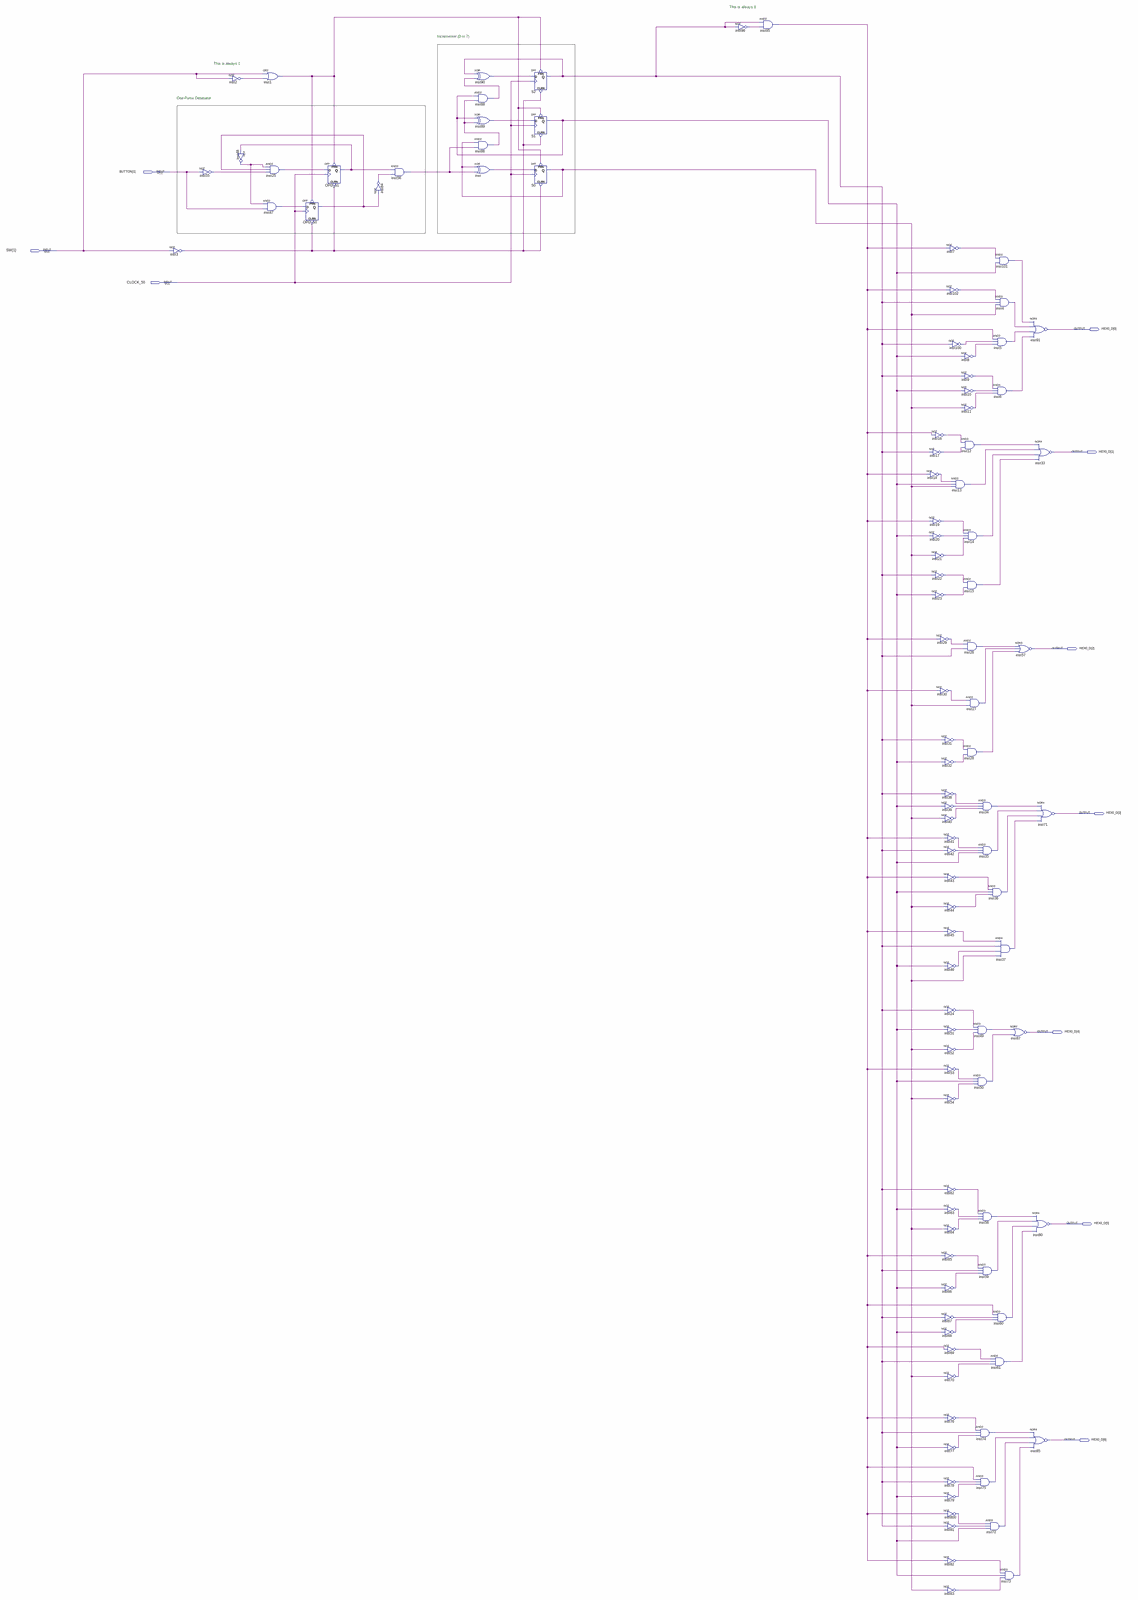
[diagram p0: schematic sheet, whole]
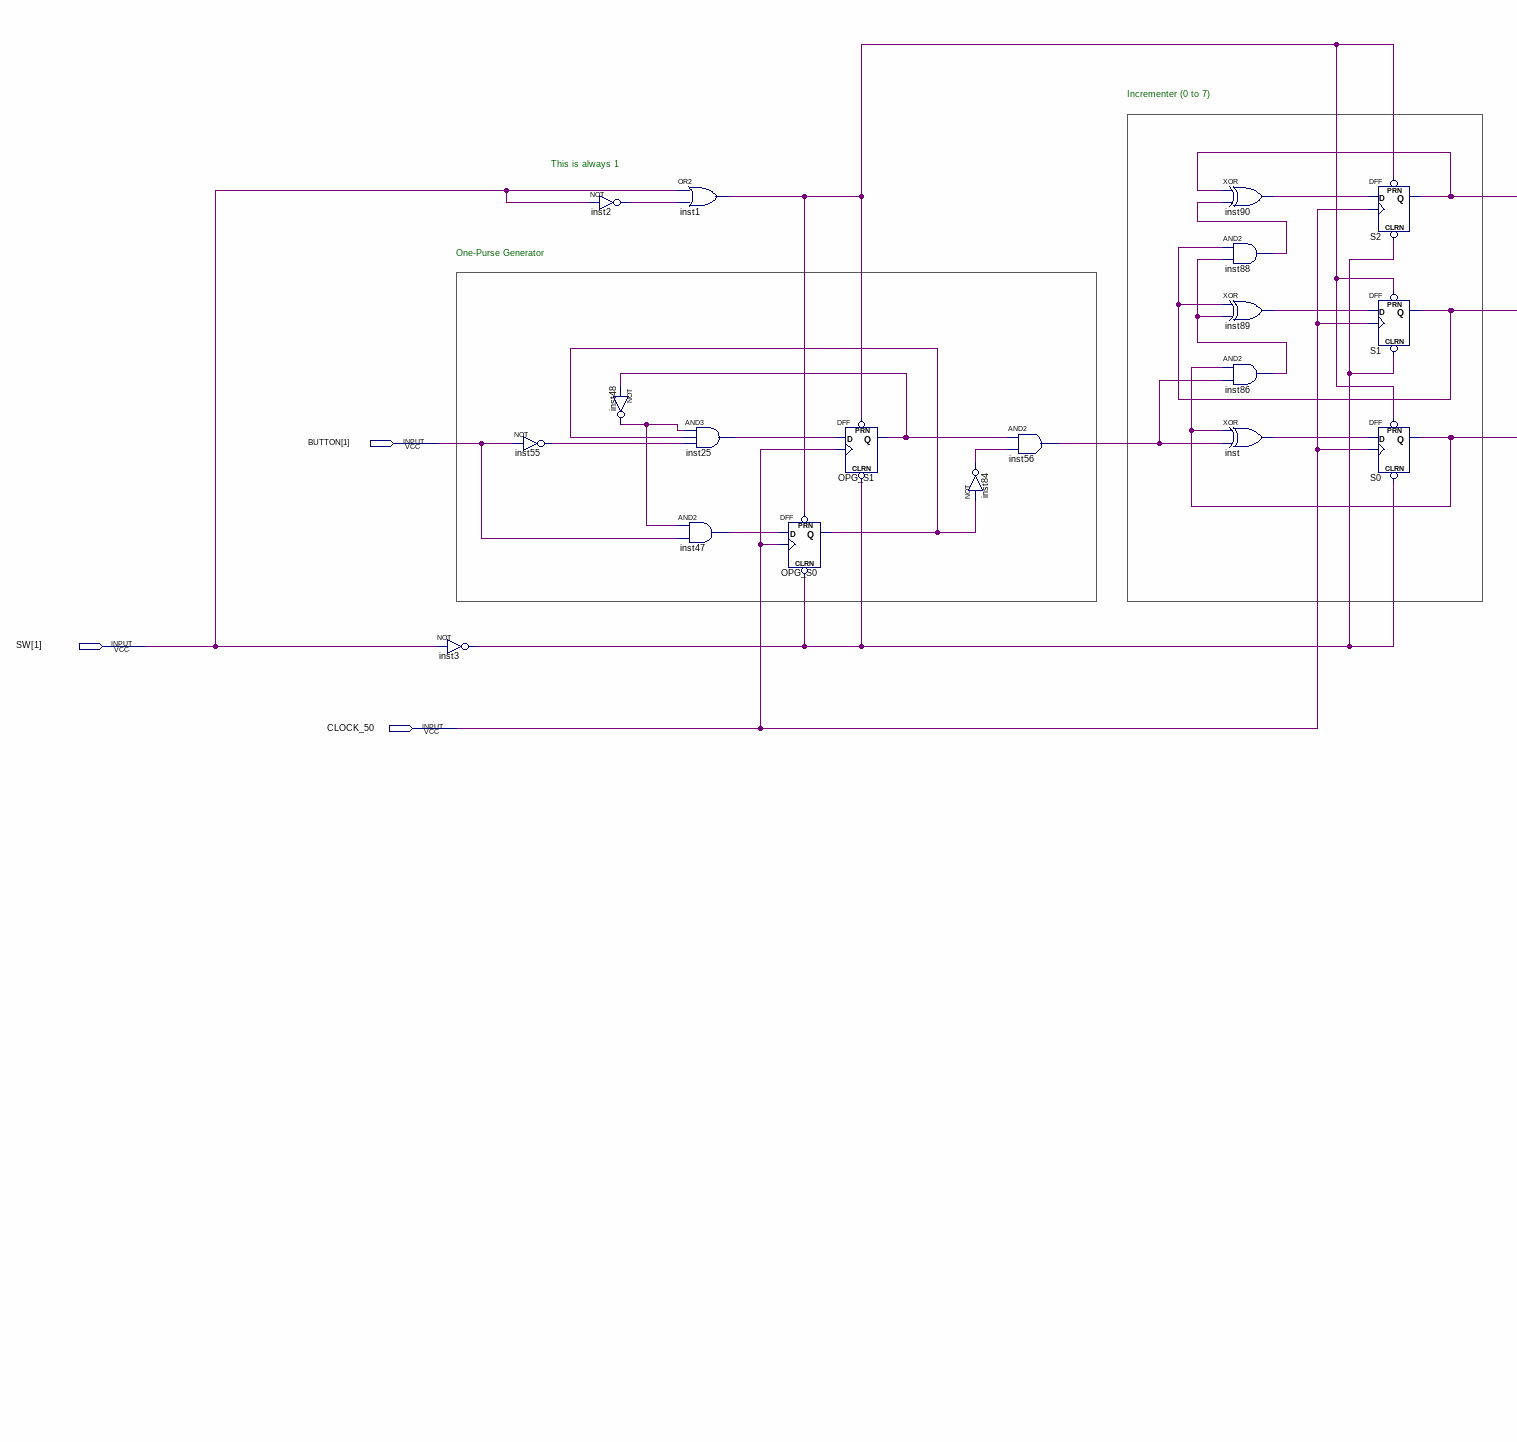
[diagram p1: schematic sheet, upper left part]
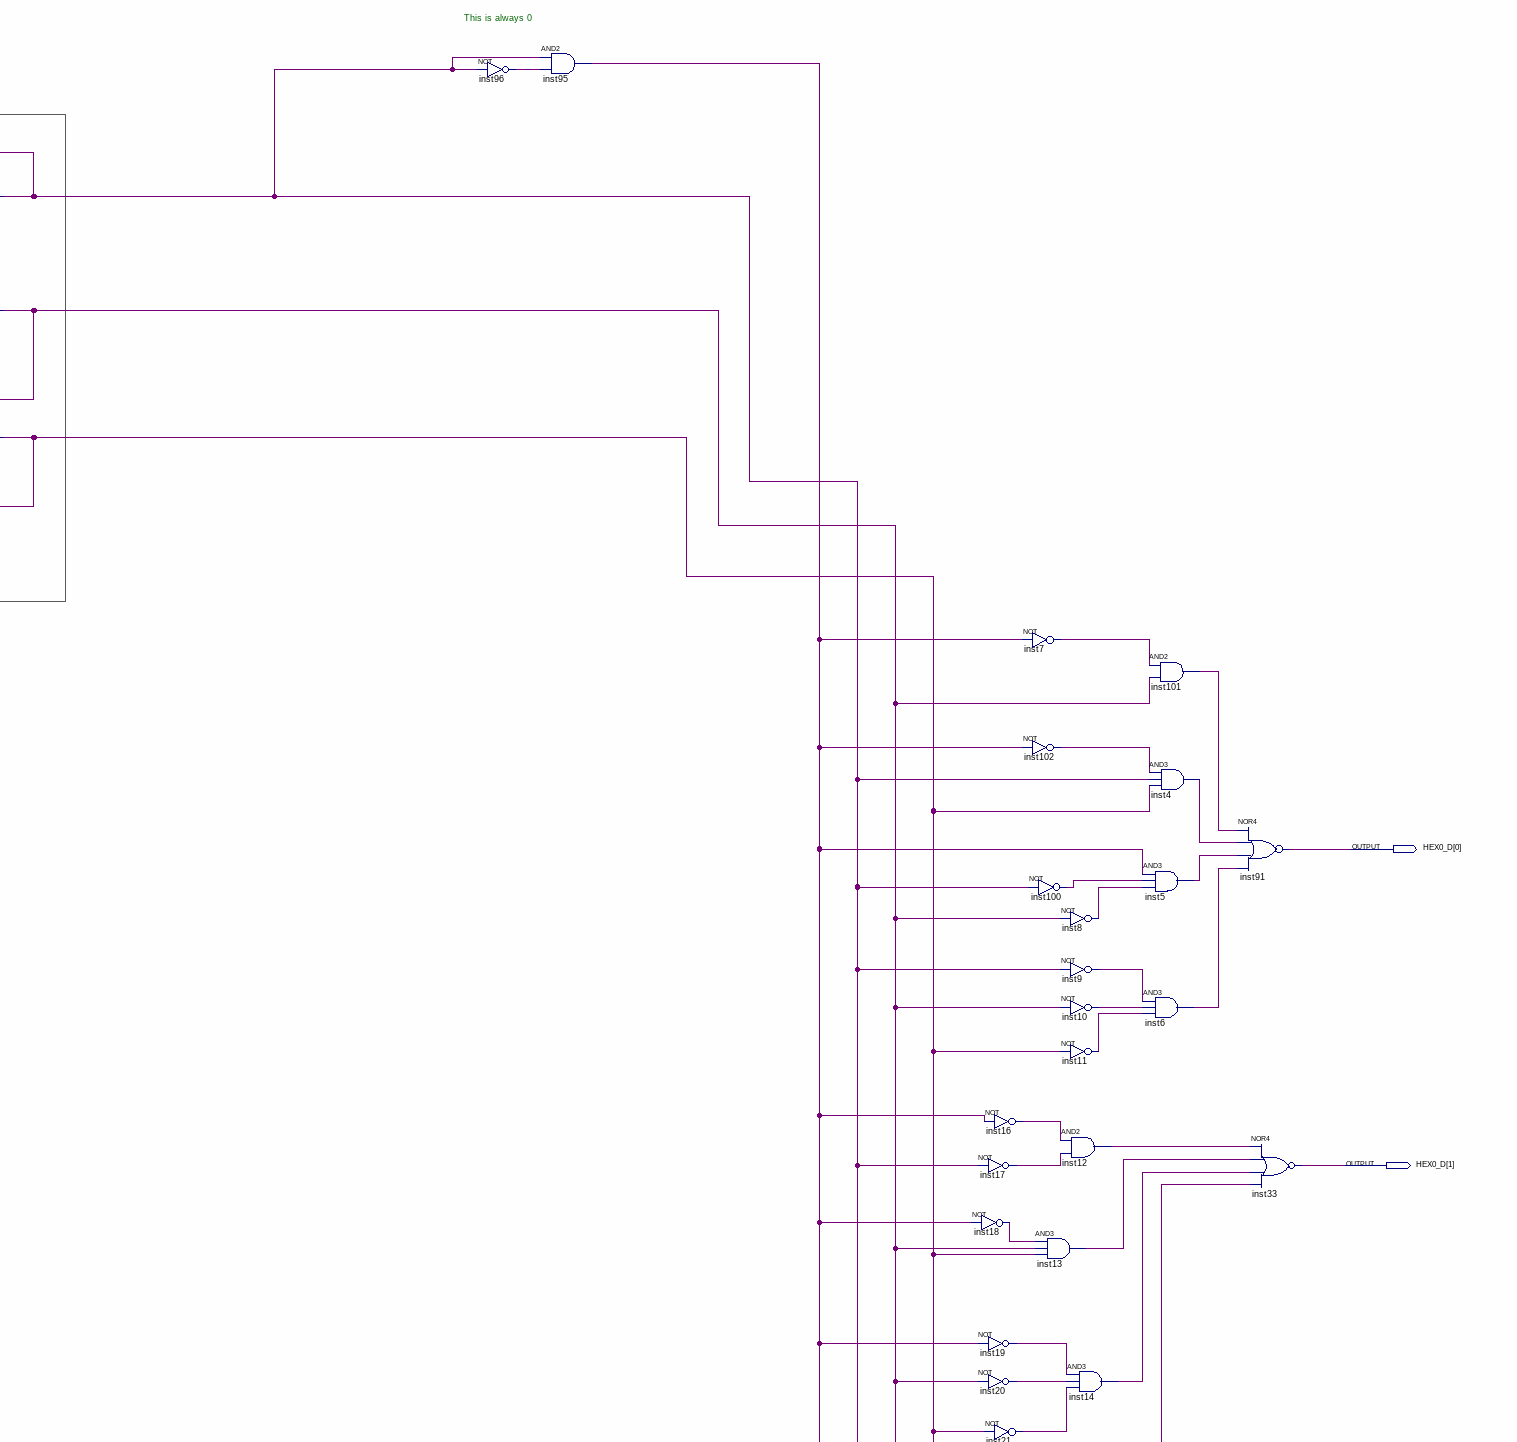
[diagram p2: schematic sheet, upper right part]
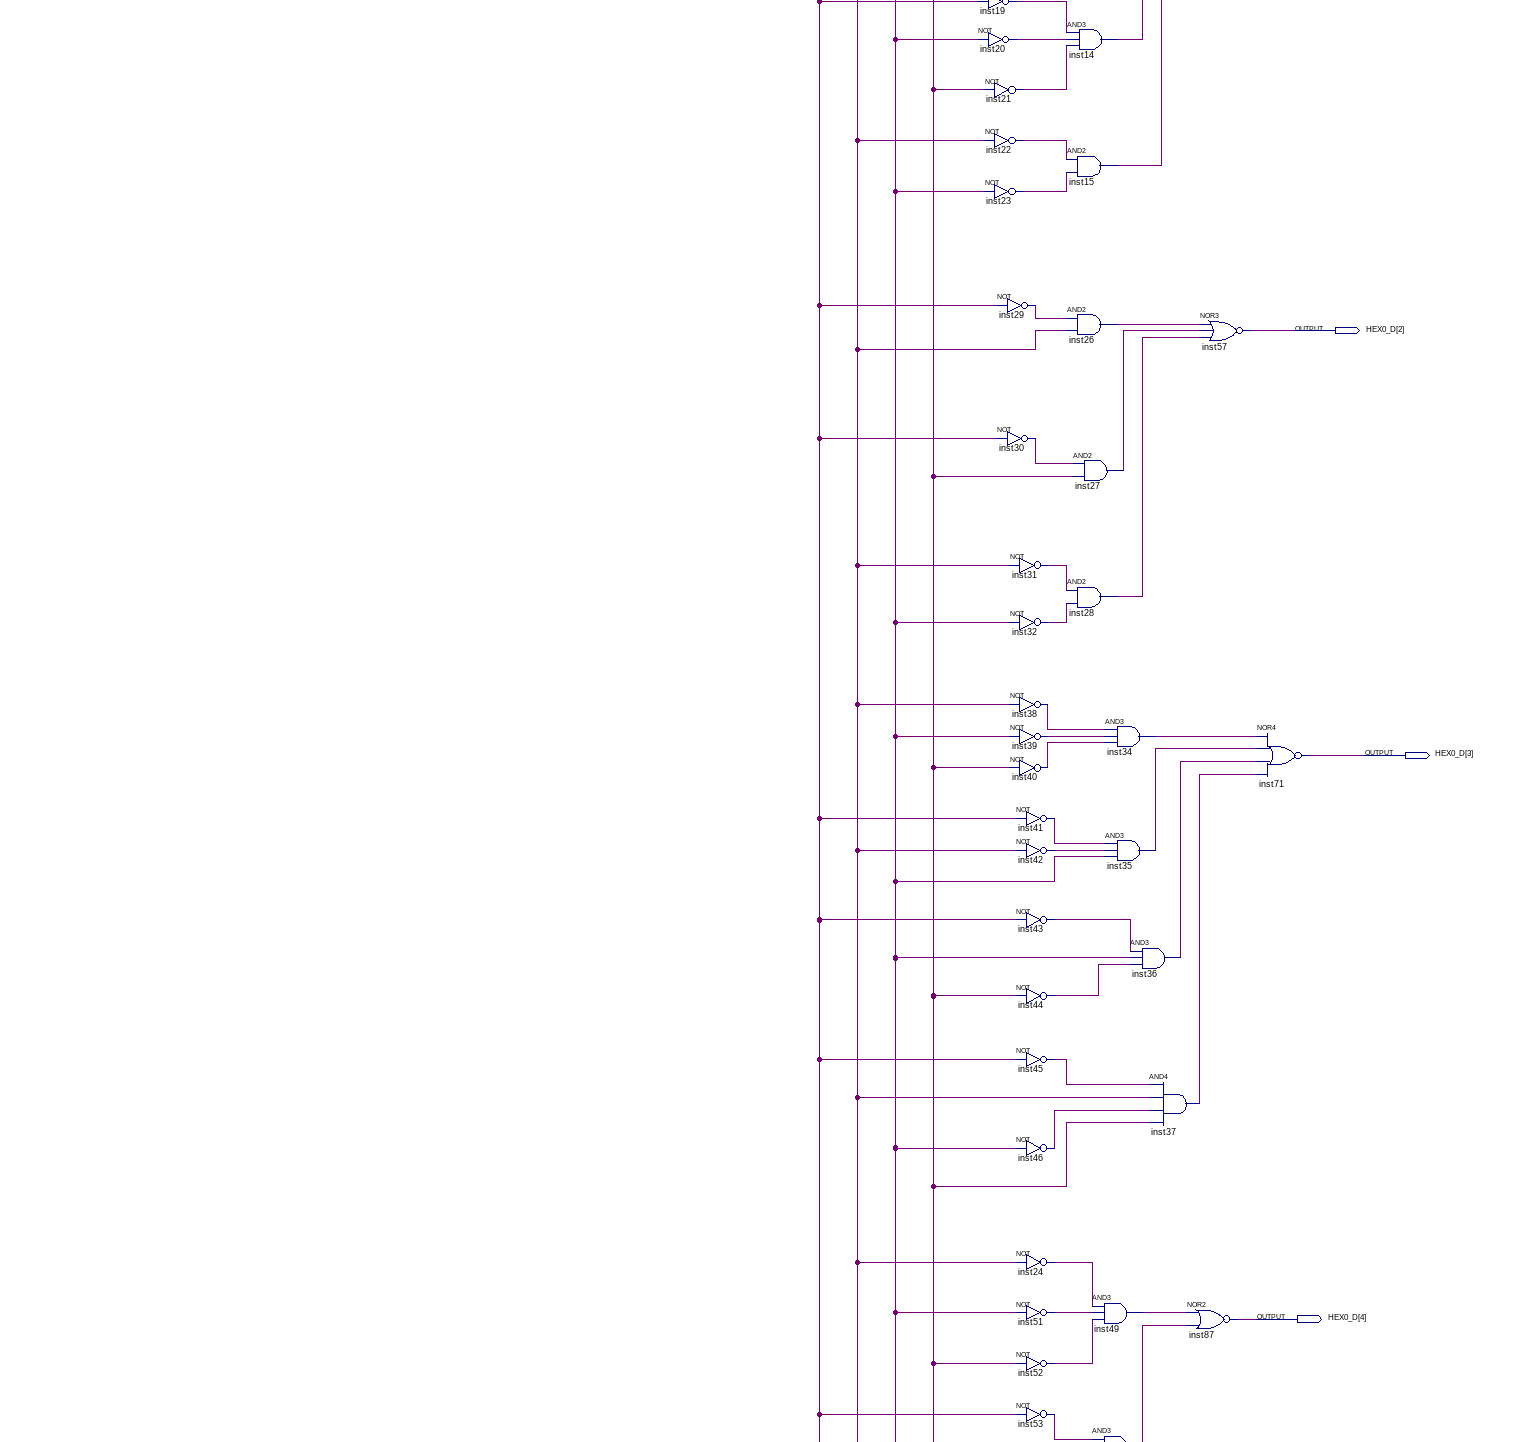
[diagram p3: schematic sheet, middle right part]
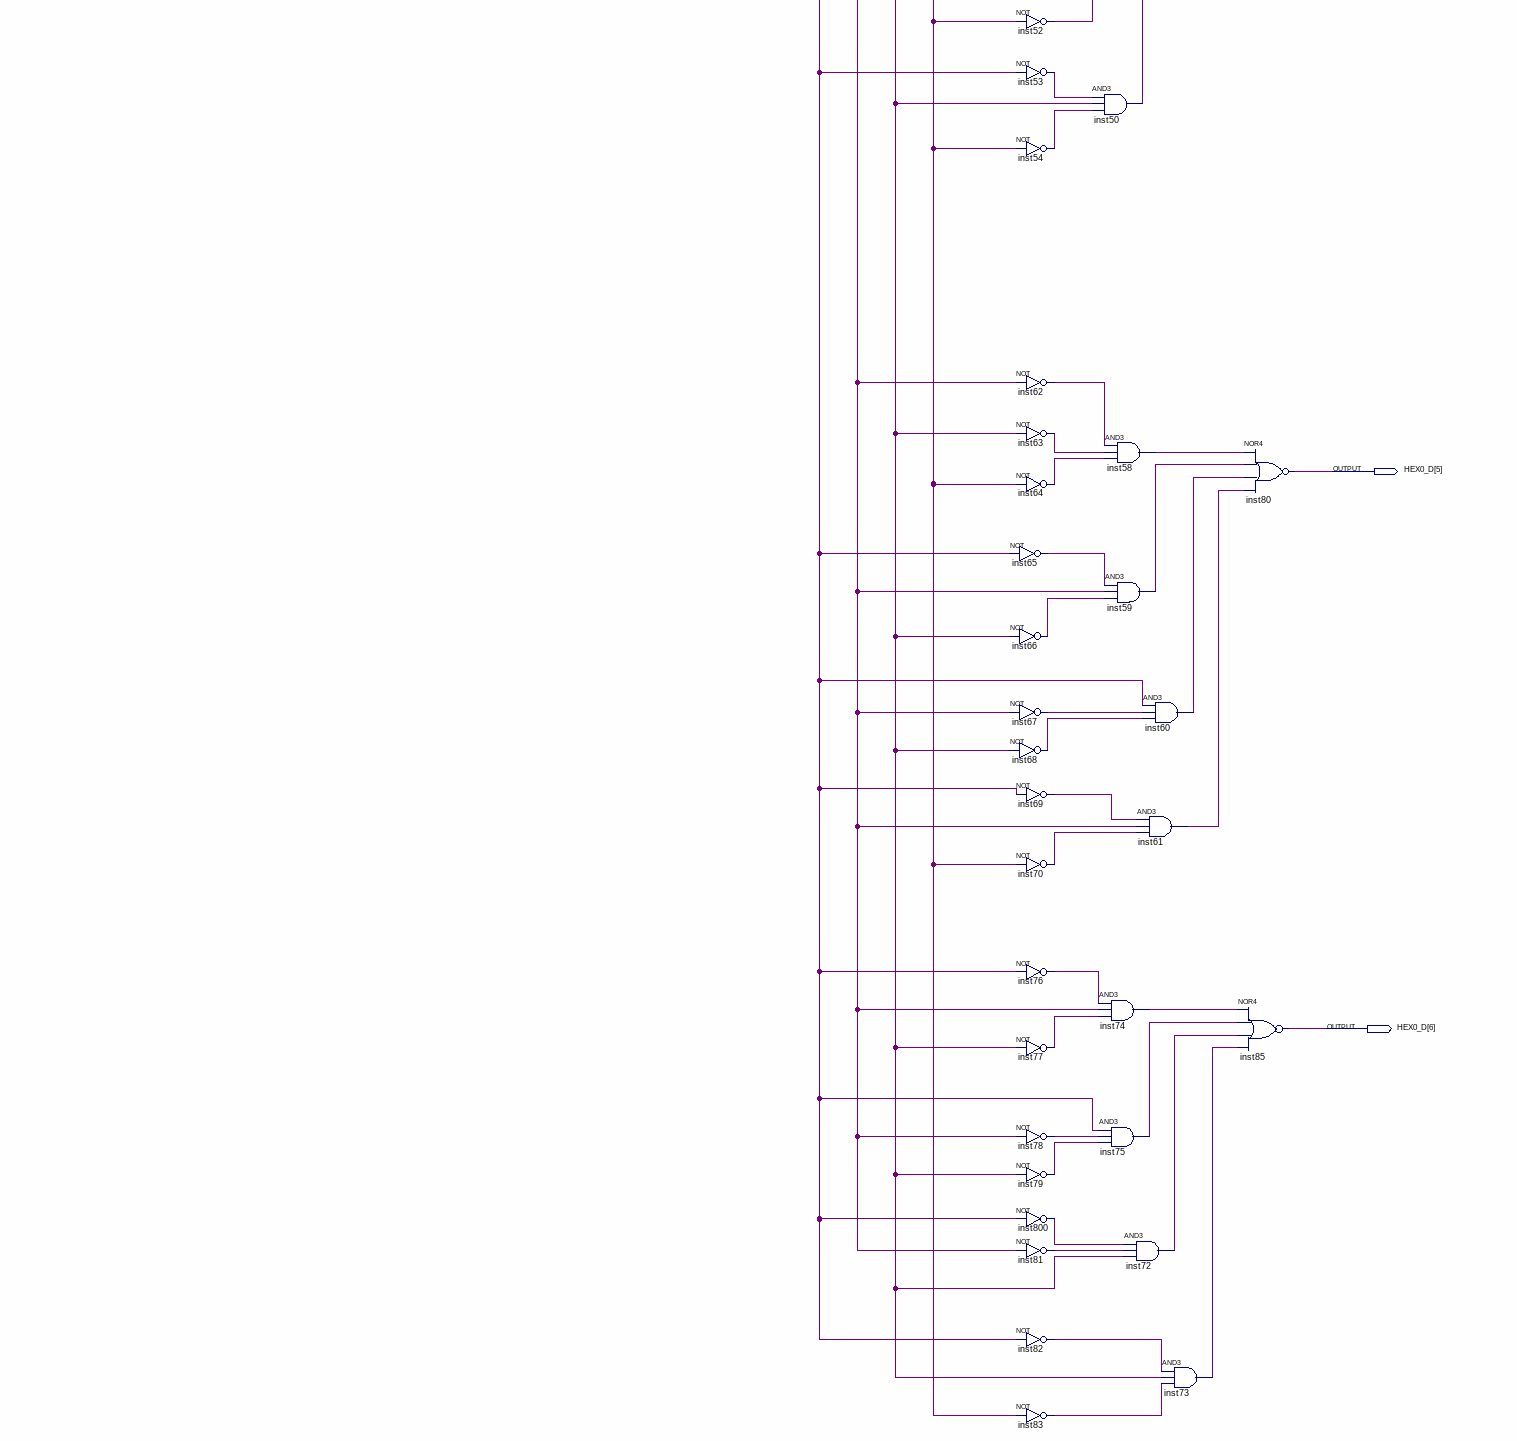
[diagram p4: schematic sheet, lower right part]
// Quartus schematic fsm.bdf as structural Verilog: 103 symbols, 10 pins
module fsm (
  input  [1:1] BUTTON,
  input  [1:1] SW,
  input  CLOCK_50,
  output [6:0] HEX0_D
);

  wire inst1_out, inst2_out, inst3_out, inst4_out, inst5_out, inst6_out, inst7_out, inst8_out, inst9_out,
       inst10_out, inst11_out, inst12_out, inst13_out, inst14_out, inst15_out, inst16_out, inst17_out,
       inst18_out, inst19_out, inst20_out, inst21_out, inst22_out, inst23_out, inst24_out, inst25_out,
       inst26_out, inst27_out, inst28_out, inst29_out, inst30_out, inst31_out, inst32_out, inst34_out,
       inst35_out, inst36_out, inst37_out, inst38_out, inst39_out, inst40_out, inst41_out, inst42_out,
       inst43_out, inst44_out, inst45_out, inst46_out, inst47_out, inst48_out, inst49_out, inst50_out,
       inst51_out, inst52_out, inst53_out, inst54_out, inst55_out, inst56_out, inst58_out, inst59_out,
       inst60_out, inst61_out, inst62_out, inst63_out, inst64_out, inst65_out, inst66_out, inst67_out,
       inst68_out, inst69_out, inst70_out, inst72_out, inst73_out, inst74_out, inst75_out, inst76_out,
       inst77_out, inst78_out, inst79_out, inst81_out, inst82_out, inst83_out, inst84_out, inst86_out,
       inst88_out, inst89_out, inst90_out, inst95_out, inst96_out, inst100_out, inst101_out, inst102_out,
       inst800_out, inst_out, OPG_S0_q, OPG_S1_q, S0_q, S1_q, S2_q;

  not inst3 (inst3_out, SW[1]);
  not inst55 (inst55_out, BUTTON[1]);
  not inst2 (inst2_out, SW[1]);
  not inst48 (inst48_out, OPG_S1_q);
  or inst1 (inst1_out, SW[1], inst2_out);
  and inst25 (inst25_out, inst48_out, OPG_S0_q, inst55_out);
  and inst47 (inst47_out, inst48_out, BUTTON[1]);
  DFF OPG_S0 (.CLRN(inst3_out), .CLK(CLOCK_50), .D(inst47_out), .PRN(inst1_out), .Q(OPG_S0_q));
  DFF OPG_S1 (.CLRN(inst3_out), .CLK(CLOCK_50), .D(inst25_out), .PRN(inst1_out), .Q(OPG_S1_q));
  and inst56 (inst56_out, OPG_S1_q, inst84_out);
  not inst84 (inst84_out, OPG_S0_q);
  xor inst90 (inst90_out, S2_q, inst88_out);
  and inst88 (inst88_out, S1_q, inst86_out);
  xor inst89 (inst89_out, S1_q, inst86_out);
  and inst86 (inst86_out, S0_q, inst56_out);
  xor inst (inst_out, S0_q, inst56_out);
  DFF S2 (.CLRN(inst3_out), .CLK(CLOCK_50), .D(inst90_out), .PRN(inst1_out), .Q(S2_q));
  DFF S1 (.CLRN(inst3_out), .CLK(CLOCK_50), .D(inst89_out), .PRN(inst1_out), .Q(S1_q));
  DFF S0 (.CLRN(inst3_out), .CLK(CLOCK_50), .D(inst_out), .PRN(inst1_out), .Q(S0_q));
  not inst96 (inst96_out, S2_q);
  and inst95 (inst95_out, S2_q, inst96_out);
  not inst16 (inst16_out, inst95_out);
  not inst17 (inst17_out, S2_q);
  not inst18 (inst18_out, inst95_out);
  not inst19 (inst19_out, inst95_out);
  not inst20 (inst20_out, S1_q);
  not inst21 (inst21_out, S0_q);
  not inst22 (inst22_out, S2_q);
  not inst23 (inst23_out, S1_q);
  not inst29 (inst29_out, inst95_out);
  not inst30 (inst30_out, inst95_out);
  not inst31 (inst31_out, S2_q);
  not inst32 (inst32_out, S1_q);
  not inst38 (inst38_out, S2_q);
  not inst39 (inst39_out, S1_q);
  not inst40 (inst40_out, S0_q);
  not inst65 (inst65_out, inst95_out);
  not inst66 (inst66_out, S1_q);
  not inst67 (inst67_out, S2_q);
  not inst68 (inst68_out, S1_q);
  not inst7 (inst7_out, inst95_out);
  not inst102 (inst102_out, inst95_out);
  not inst100 (inst100_out, S2_q);
  not inst8 (inst8_out, S1_q);
  not inst9 (inst9_out, S2_q);
  not inst10 (inst10_out, S1_q);
  not inst11 (inst11_out, S0_q);
  and inst12 (inst12_out, inst16_out, inst17_out);
  and inst13 (inst13_out, inst18_out, S1_q, S0_q);
  not inst41 (inst41_out, inst95_out);
  not inst42 (inst42_out, S2_q);
  not inst43 (inst43_out, inst95_out);
  not inst44 (inst44_out, S0_q);
  not inst45 (inst45_out, inst95_out);
  not inst46 (inst46_out, S1_q);
  not inst24 (inst24_out, S2_q);
  not inst51 (inst51_out, S1_q);
  not inst52 (inst52_out, S0_q);
  not inst53 (inst53_out, inst95_out);
  not inst54 (inst54_out, S0_q);
  not inst62 (inst62_out, S2_q);
  not inst63 (inst63_out, S1_q);
  not inst64 (inst64_out, S0_q);
  not inst69 (inst69_out, inst95_out);
  not inst70 (inst70_out, S0_q);
  not inst76 (inst76_out, inst95_out);
  not inst77 (inst77_out, S1_q);
  not inst78 (inst78_out, S2_q);
  not inst79 (inst79_out, S1_q);
  not inst800 (inst800_out, inst95_out);
  not inst81 (inst81_out, S2_q);
  not inst82 (inst82_out, inst95_out);
  not inst83 (inst83_out, S0_q);
  and inst14 (inst14_out, inst19_out, inst20_out, inst21_out);
  and inst15 (inst15_out, inst22_out, inst23_out);
  and inst26 (inst26_out, inst29_out, S2_q);
  and inst27 (inst27_out, inst30_out, S0_q);
  and inst28 (inst28_out, inst31_out, inst32_out);
  and inst34 (inst34_out, inst38_out, inst39_out, inst40_out);
  and inst35 (inst35_out, inst41_out, inst42_out, S1_q);
  and inst49 (inst49_out, inst24_out, inst51_out, inst52_out);
  and inst50 (inst50_out, inst53_out, S1_q, inst54_out);
  and inst58 (inst58_out, inst62_out, inst63_out, inst64_out);
  and inst59 (inst59_out, inst65_out, S2_q, inst66_out);
  and inst74 (inst74_out, inst76_out, S2_q, inst77_out);
  and inst75 (inst75_out, inst95_out, inst78_out, inst79_out);
  and inst101 (inst101_out, inst7_out, S1_q);
  and inst4 (inst4_out, inst102_out, S2_q, S0_q);
  and inst5 (inst5_out, inst95_out, inst100_out, inst8_out);
  and inst6 (inst6_out, inst9_out, inst10_out, inst11_out);
  and inst36 (inst36_out, inst43_out, S1_q, inst44_out);
  and inst37 (inst37_out, inst45_out, S2_q, inst46_out, S0_q);
  and inst60 (inst60_out, inst95_out, inst67_out, inst68_out);
  and inst61 (inst61_out, inst69_out, S2_q, inst70_out);
  and inst72 (inst72_out, inst800_out, inst81_out, S1_q);
  and inst73 (inst73_out, inst82_out, S1_q, inst83_out);
  nor inst57 (HEX0_D[2], inst26_out, inst27_out, inst28_out);
  nor inst87 (HEX0_D[4], inst49_out, inst50_out);
  nor inst91 (HEX0_D[0], inst101_out, inst4_out, inst5_out, inst6_out);
  nor inst33 (HEX0_D[1], inst12_out, inst13_out, inst14_out, inst15_out);
  nor inst71 (HEX0_D[3], inst34_out, inst35_out, inst36_out, inst37_out);
  nor inst80 (HEX0_D[5], inst58_out, inst59_out, inst60_out, inst61_out);
  nor inst85 (HEX0_D[6], inst74_out, inst75_out, inst72_out, inst73_out);

  // Notes on the sheet:
  //   This is always 0           
  //   Incrementer (0 to 7)        
  //   This is always 1      
  //   One-Purse Generator             
endmodule
